# Altium schematic sheet 4.CAN.SchDoc
size A4
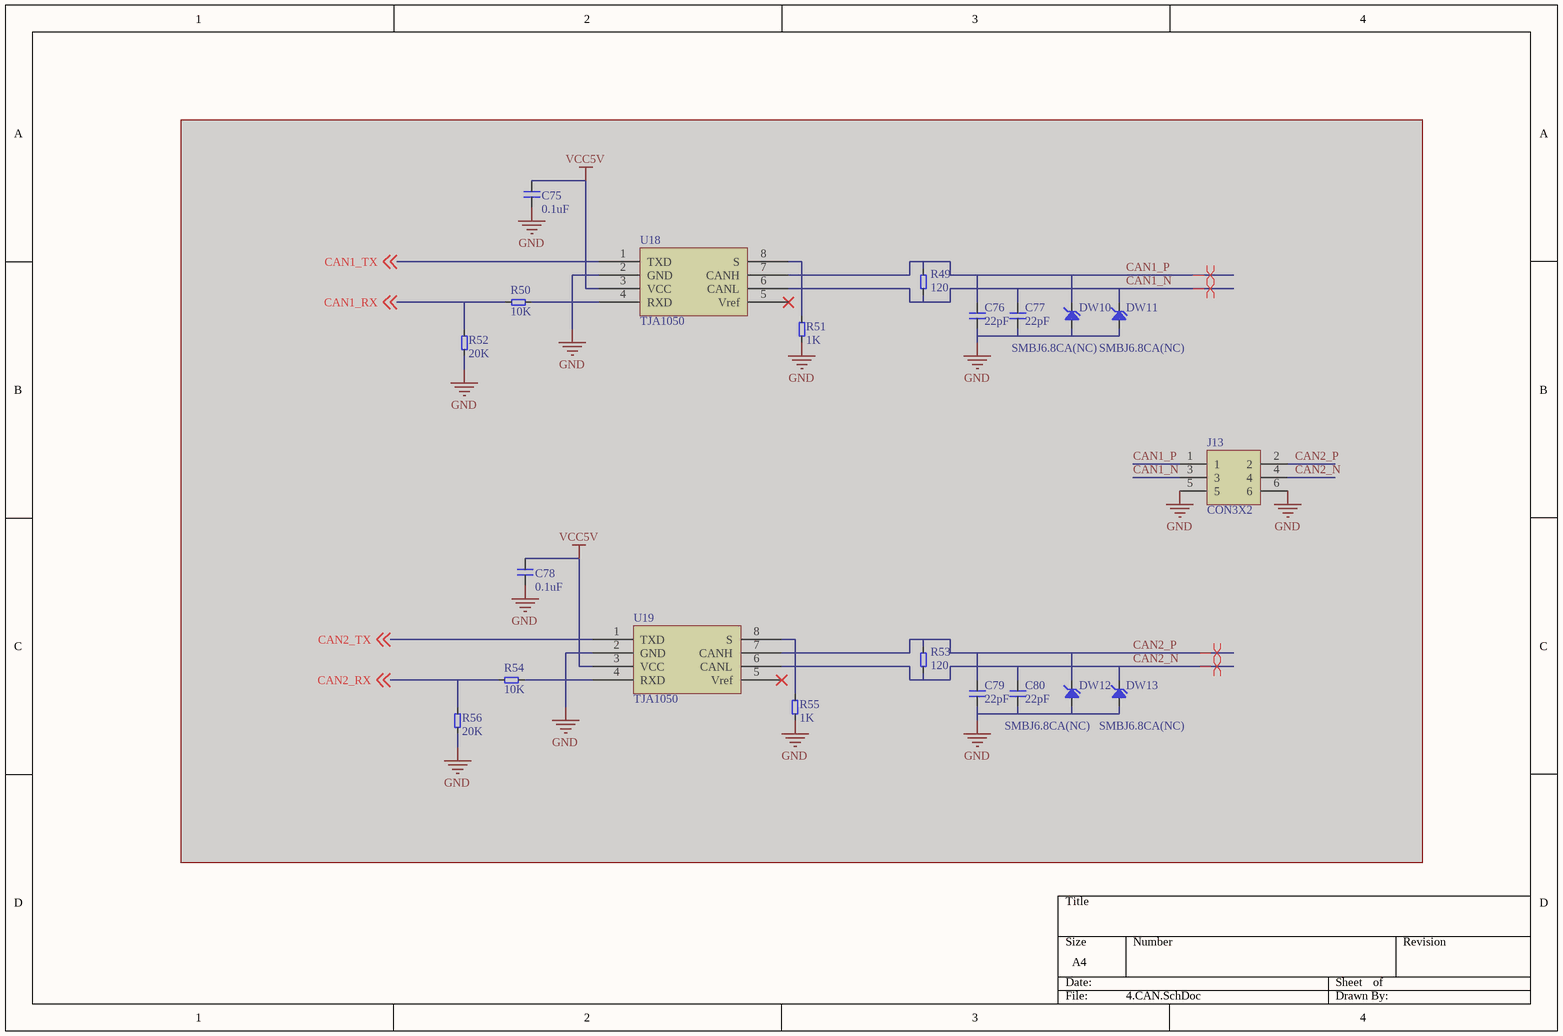
[diagram p0: 4.CAN.SchDoc]

## Parts
C75  0.1uF  [0603C]  (masked out: inside a compile mask, not in the netlist)
C76  22pF  [0603C]  (masked out: inside a compile mask, not in the netlist)
C77  22pF  [0603C]  (masked out: inside a compile mask, not in the netlist)
C78  0.1uF  [0603C]  (masked out: inside a compile mask, not in the netlist)
C79  22pF  [0603C]  (masked out: inside a compile mask, not in the netlist)
C80  22pF  [0603C]  (masked out: inside a compile mask, not in the netlist)
DW10  SMBJ6.8CA(NC)  [SMA]  (masked out: inside a compile mask, not in the netlist)
DW11  SMBJ6.8CA(NC)  [SMA]  (masked out: inside a compile mask, not in the netlist)
DW12  SMBJ6.8CA(NC)  [SMA]  (masked out: inside a compile mask, not in the netlist)
DW13  SMBJ6.8CA(NC)  [SMA]  (masked out: inside a compile mask, not in the netlist)
J13  CON3X2  [IDC3X2-2.54MM]  (masked out: inside a compile mask, not in the netlist)
R49  120  [0603R]  (masked out: inside a compile mask, not in the netlist)
R50  10K  [0603R]  (masked out: inside a compile mask, not in the netlist)
R51  1K  [0603R]  (masked out: inside a compile mask, not in the netlist)
R52  20K  [0603R]  (masked out: inside a compile mask, not in the netlist)
R53  120  [0603R]  (masked out: inside a compile mask, not in the netlist)
R54  10K  [0603R]  (masked out: inside a compile mask, not in the netlist)
R55  1K  [0603R]  (masked out: inside a compile mask, not in the netlist)
R56  20K  [0603R]  (masked out: inside a compile mask, not in the netlist)
U18  TJA1050  [SOP8-1.27]  (masked out: inside a compile mask, not in the netlist)
U19  TJA1050  [SOP8-1.27]  (masked out: inside a compile mask, not in the netlist)

## Layout directives
differential pair: (no net found under the mark)

## Library data of the parts
C75-C80 = 电容
DW10-DW13 = 肖特基二极管
R49-R56 = 电阻